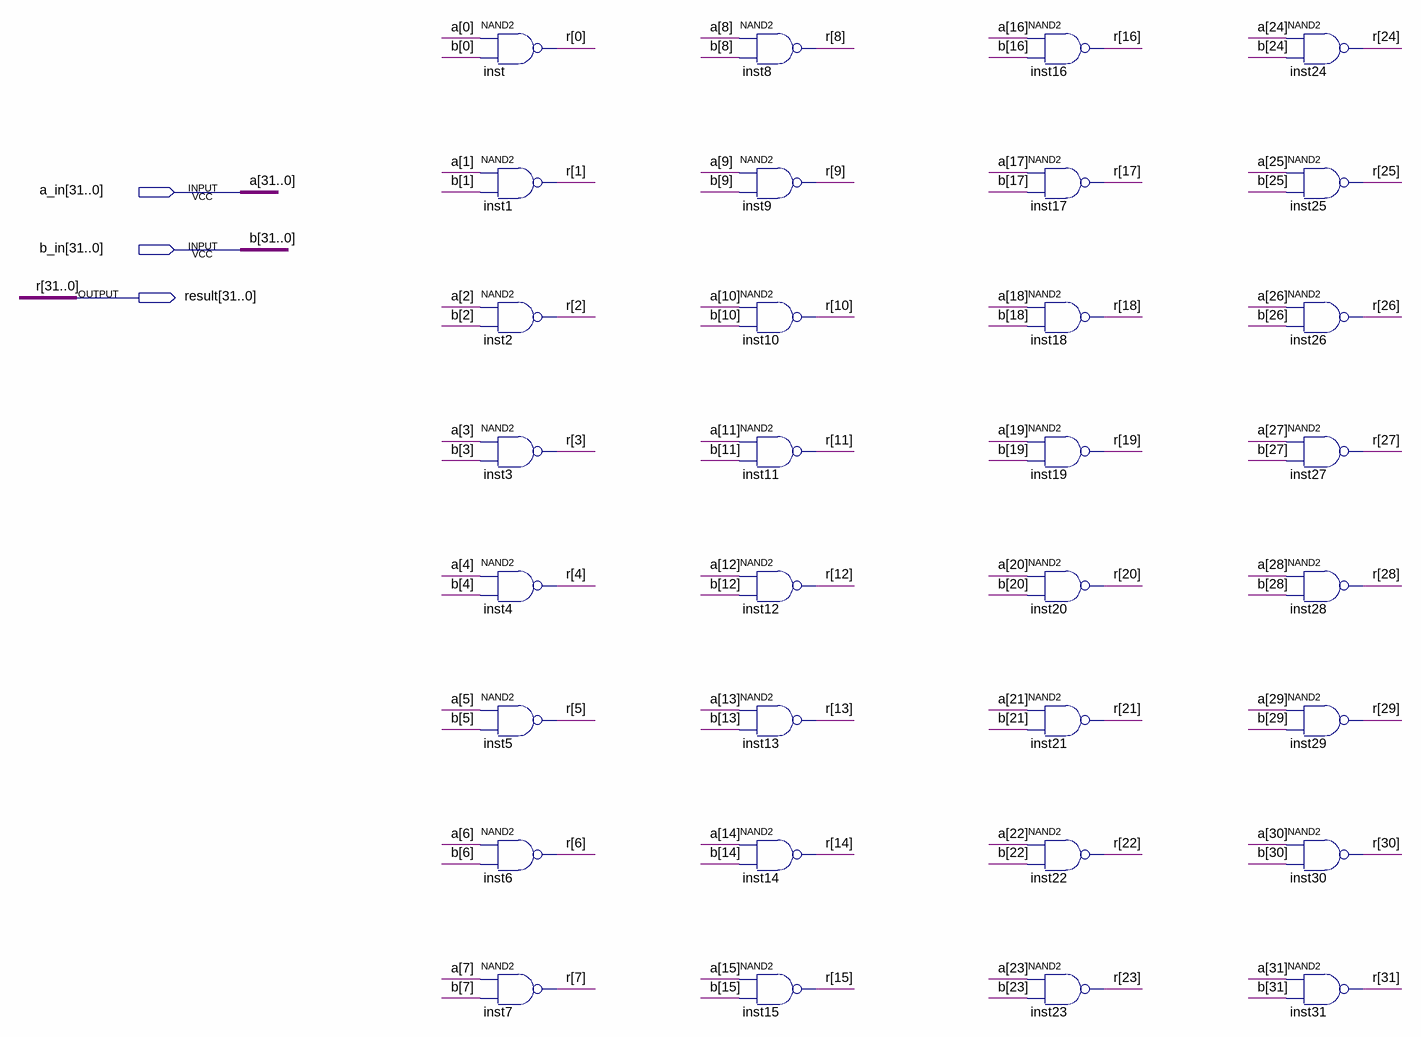
[diagram p0: schematic sheet]
// Quartus schematic NandComponent.bdf as structural Verilog: 32 symbols, 3 pins
module NandComponent (
  input  [31:0] a_in,
  input  [31:0] b_in,
  output [31:0] result
);

  nand inst (result[0], a_in[0], b_in[0]);
  nand inst1 (result[1], a_in[1], b_in[1]);
  nand inst2 (result[2], a_in[2], b_in[2]);
  nand inst3 (result[3], a_in[3], b_in[3]);
  nand inst4 (result[4], a_in[4], b_in[4]);
  nand inst5 (result[5], a_in[5], b_in[5]);
  nand inst6 (result[6], a_in[6], b_in[6]);
  nand inst7 (result[7], a_in[7], b_in[7]);
  nand inst8 (result[8], a_in[8], b_in[8]);
  nand inst9 (result[9], a_in[9], b_in[9]);
  nand inst10 (result[10], a_in[10], b_in[10]);
  nand inst11 (result[11], a_in[11], b_in[11]);
  nand inst12 (result[12], a_in[12], b_in[12]);
  nand inst13 (result[13], a_in[13], b_in[13]);
  nand inst14 (result[14], a_in[14], b_in[14]);
  nand inst15 (result[15], a_in[15], b_in[15]);
  nand inst16 (result[16], a_in[16], b_in[16]);
  nand inst17 (result[17], a_in[17], b_in[17]);
  nand inst18 (result[18], a_in[18], b_in[18]);
  nand inst19 (result[19], a_in[19], b_in[19]);
  nand inst20 (result[20], a_in[20], b_in[20]);
  nand inst21 (result[21], a_in[21], b_in[21]);
  nand inst22 (result[22], a_in[22], b_in[22]);
  nand inst23 (result[23], a_in[23], b_in[23]);
  nand inst24 (result[24], a_in[24], b_in[24]);
  nand inst25 (result[25], a_in[25], b_in[25]);
  nand inst26 (result[26], a_in[26], b_in[26]);
  nand inst27 (result[27], a_in[27], b_in[27]);
  nand inst28 (result[28], a_in[28], b_in[28]);
  nand inst29 (result[29], a_in[29], b_in[29]);
  nand inst30 (result[30], a_in[30], b_in[30]);
  nand inst31 (result[31], a_in[31], b_in[31]);

  // Other names for the same wires on the sheet: a[31:0] = a_in; b[31:0] = b_in; r[31:0] = result
endmodule
